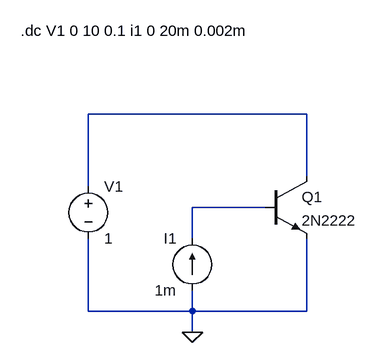
[diagram p0: schematic E3.asc]
E3.asc, the LTspice schematic file:
Version 4
SHEET 1 880 680
WIRE 416 304 80 304
WIRE 416 400 416 304
WIRE 80 416 80 304
WIRE 352 448 240 448
WIRE 240 496 240 448
WIRE 80 608 80 496
WIRE 240 608 240 576
WIRE 240 608 80 608
WIRE 416 608 416 496
WIRE 416 608 240 608
WIRE 240 640 240 608
FLAG 240 640 0
SYMBOL voltage 80 400 R0
SYMATTR InstName V1
SYMATTR Value 1
SYMBOL npn 352 400 R0
SYMATTR InstName Q1
SYMATTR Value 2N2222
SYMBOL current 240 576 R180
WINDOW 0 24 80 Left 2
WINDOW 3 24 0 Left 2
SYMATTR InstName I1
SYMATTR Value 1m
TEXT -24 176 Left 2 !.dc V1 0 10 0.1 i1 0 20m 0.002m

The netlist it stands for:
* E3.asc
V1 N001 0 1
Q1 N001 N002 0 0 2N2222
I1 0 N002 1m
.model NPN NPN
.model PNP PNP
.lib standard.bjt
.dc V1 0 10 0.1 i1 0 20m 0.002m
.backanno
.end